# EAGLE design 8-Bit Selector (2-to-1) (EAGLE 7.5.0)
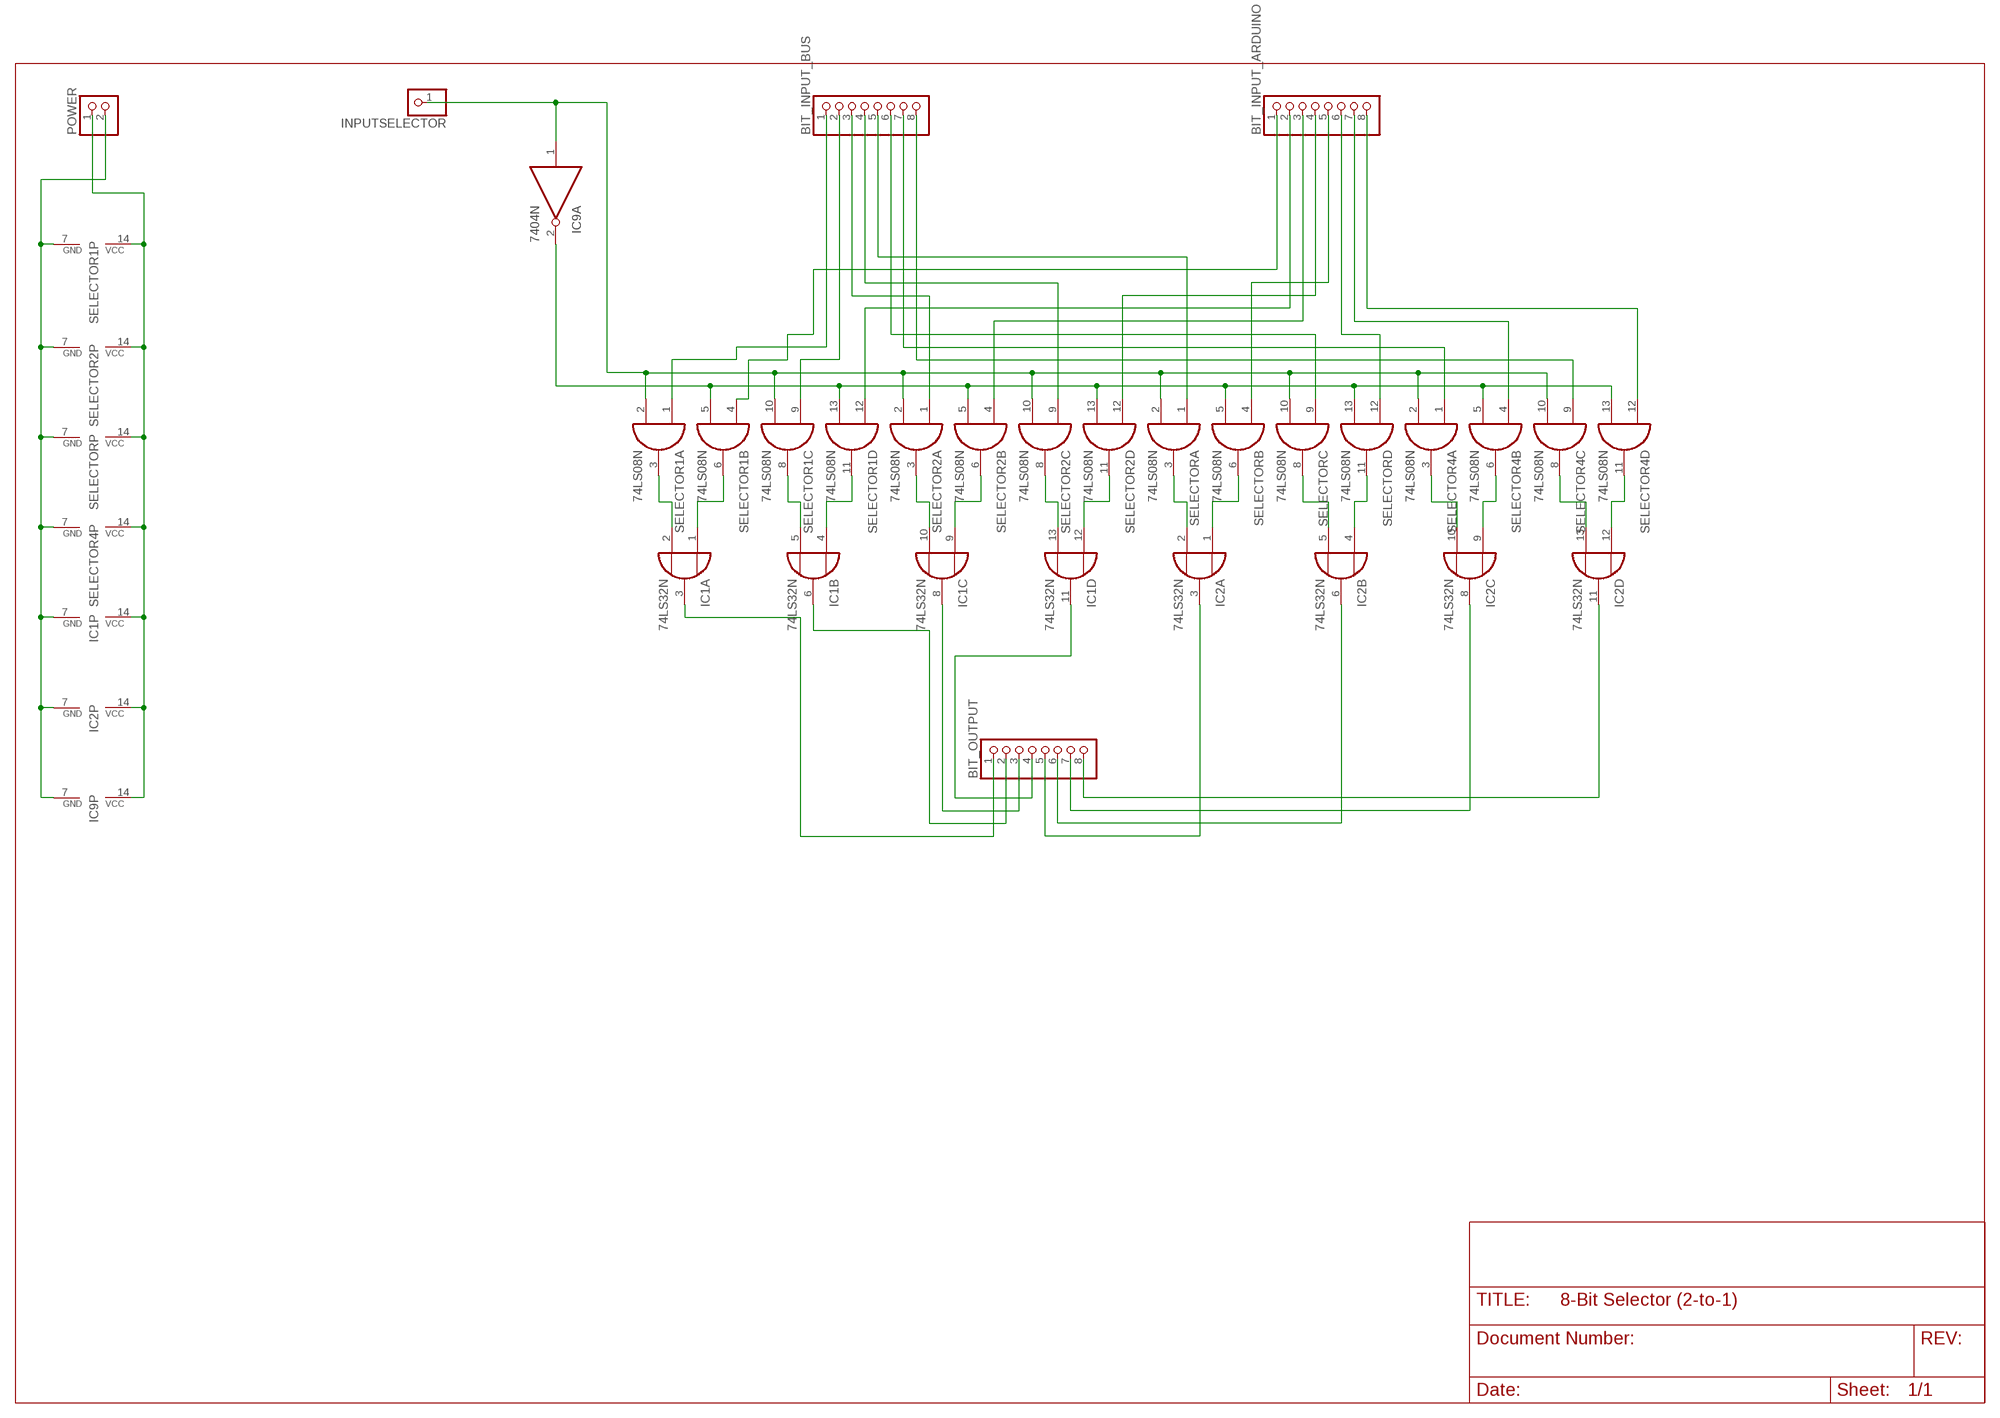
[diagram p0: schematic, sheet 1]

## Parts
BIT_INPUT_ARDUINO  PINHD-1X8  [1X08]
BIT_INPUT_BUS  PINHD-1X8  [1X08]
BIT_OUTPUT  PINHD-1X8  [1X08]
IC1  74LS32N  [DIL14]
IC2  74LS32N  [DIL14]
IC9  7404N  [DIL14]
INPUTSELECTOR  PINHD-1X1  [1X01]
POWER  PINHD-1X2  [1X02]
SELECTOR  74LS08N  [DIL14]
SELECTOR1  74LS08N  [DIL14]
SELECTOR2  74LS08N  [DIL14]
SELECTOR4  74LS08N  [DIL14]

## Nets
GND: IC1.7(P:GND) IC2.7(P:GND) IC9.7(P:GND) POWER.2 SELECTOR1.7(P:GND) SELECTOR2.7(P:GND) SELECTOR4.7(P:GND) SELECTOR.7(P:GND)
N$3: IC9.1(A:I) INPUTSELECTOR.1 SELECTOR1.2(A:I1) SELECTOR1.10(C:I1) SELECTOR2.2(A:I1) SELECTOR2.10(C:I1) SELECTOR4.2(A:I1) SELECTOR4.10(C:I1) SELECTOR.2(A:I1) SELECTOR.10(C:I1)
N$5: IC9.2(A:O) SELECTOR1.5(B:I1) SELECTOR1.13(D:I1) SELECTOR2.5(B:I1) SELECTOR2.13(D:I1) SELECTOR4.5(B:I1) SELECTOR4.13(D:I1) SELECTOR.5(B:I1) SELECTOR.13(D:I1)
N$6: BIT_INPUT_BUS.1 SELECTOR1.1(A:I0)
N$7: BIT_INPUT_ARDUINO.1 SELECTOR1.4(B:I0)
N$8: BIT_INPUT_BUS.2 SELECTOR1.9(C:I0)
N$9: BIT_INPUT_ARDUINO.2 SELECTOR1.12(D:I0)
N$10: BIT_INPUT_BUS.3 SELECTOR2.1(A:I0)
N$11: BIT_INPUT_ARDUINO.3 SELECTOR2.4(B:I0)
N$12: BIT_INPUT_BUS.4 SELECTOR2.9(C:I0)
N$13: BIT_INPUT_ARDUINO.4 SELECTOR2.12(D:I0)
N$14: BIT_INPUT_BUS.5 SELECTOR.1(A:I0)
N$15: BIT_INPUT_ARDUINO.5 SELECTOR.4(B:I0)
N$16: BIT_INPUT_BUS.6 SELECTOR.9(C:I0)
N$17: BIT_INPUT_ARDUINO.6 SELECTOR.12(D:I0)
N$18: BIT_INPUT_BUS.7 SELECTOR4.1(A:I0)
N$19: BIT_INPUT_ARDUINO.7 SELECTOR4.4(B:I0)
N$20: BIT_INPUT_BUS.8 SELECTOR4.9(C:I0)
N$21: BIT_INPUT_ARDUINO.8 SELECTOR4.12(D:I0)
N$30: BIT_OUTPUT.6 IC2.6(B:O)
N$39: IC1.2(A:I1) SELECTOR1.3(A:O)
N$40: IC1.1(A:I0) SELECTOR1.6(B:O)
N$41: IC1.5(B:I1) SELECTOR1.8(C:O)
N$42: IC1.4(B:I0) SELECTOR1.11(D:O)
N$43: IC1.10(C:I1) SELECTOR2.3(A:O)
N$44: IC1.9(C:I0) SELECTOR2.6(B:O)
N$45: IC1.13(D:I1) SELECTOR2.8(C:O)
N$46: IC1.12(D:I0) SELECTOR2.11(D:O)
N$47: IC2.2(A:I1) SELECTOR.3(A:O)
N$48: IC2.1(A:I0) SELECTOR.6(B:O)
N$49: IC2.5(B:I1) SELECTOR.8(C:O)
N$50: IC2.4(B:I0) SELECTOR.11(D:O)
N$51: IC2.10(C:I1) SELECTOR4.3(A:O)
N$52: IC2.9(C:I0) SELECTOR4.6(B:O)
N$53: IC2.13(D:I1) SELECTOR4.8(C:O)
N$54: IC2.12(D:I0) SELECTOR4.11(D:O)
N$55: BIT_OUTPUT.1 IC1.3(A:O)
N$72: BIT_OUTPUT.2 IC1.6(B:O)
N$73: BIT_OUTPUT.3 IC1.8(C:O)
N$74: BIT_OUTPUT.4 IC1.11(D:O)
N$75: BIT_OUTPUT.5 IC2.3(A:O)
N$76: BIT_OUTPUT.7 IC2.8(C:O)
N$77: BIT_OUTPUT.8 IC2.11(D:O)
VCC: IC1.14(P:VCC) IC2.14(P:VCC) IC9.14(P:VCC) POWER.1 SELECTOR1.14(P:VCC) SELECTOR2.14(P:VCC) SELECTOR4.14(P:VCC) SELECTOR.14(P:VCC)
Unconnected: IC9.3(B:I) IC9.4(B:O) IC9.5(C:I) IC9.6(C:O) IC9.8(D:O) IC9.9(D:I) IC9.10(E:O) IC9.11(E:I) IC9.12(F:O) IC9.13(F:I)

## Library data of the parts
BIT_INPUT_ARDUINO BIT_INPUT_BUS BIT_OUTPUT = pinhead:PINHD-1X8: PIN HEADER
IC1 IC2 = 74xx-eu:74*32: Quad 2-input OR gate
IC9 = 74xx-eu:74*04: Hex INVERTER
INPUTSELECTOR = pinhead:PINHD-1X1: PIN HEADER
POWER = pinhead:PINHD-1X2: PIN HEADER
SELECTOR SELECTOR1 SELECTOR2 SELECTOR4 = 74xx-eu:74*08: Quad 2-input AND gate

## Board
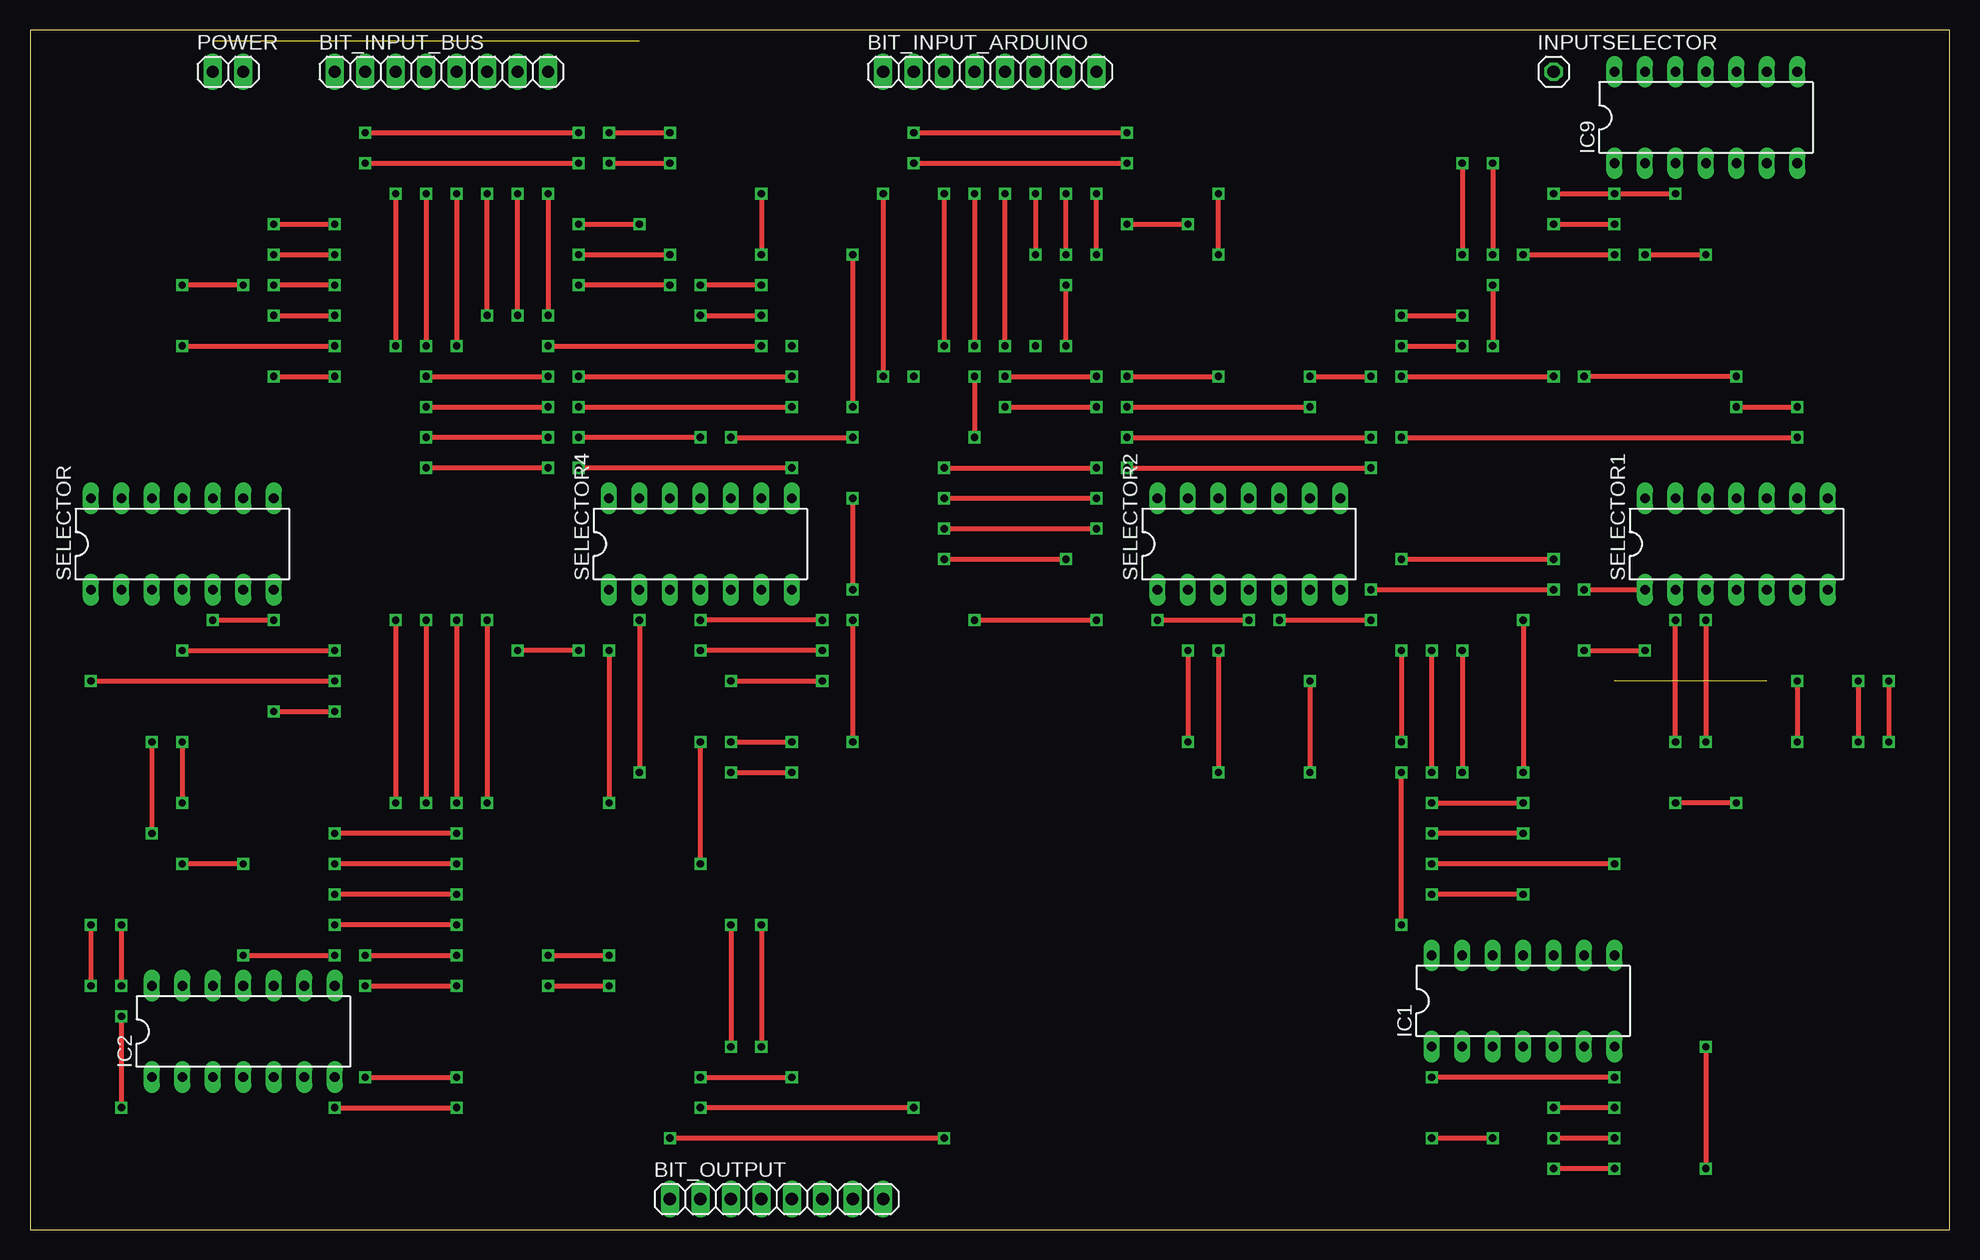
[diagram p1: board, top side]
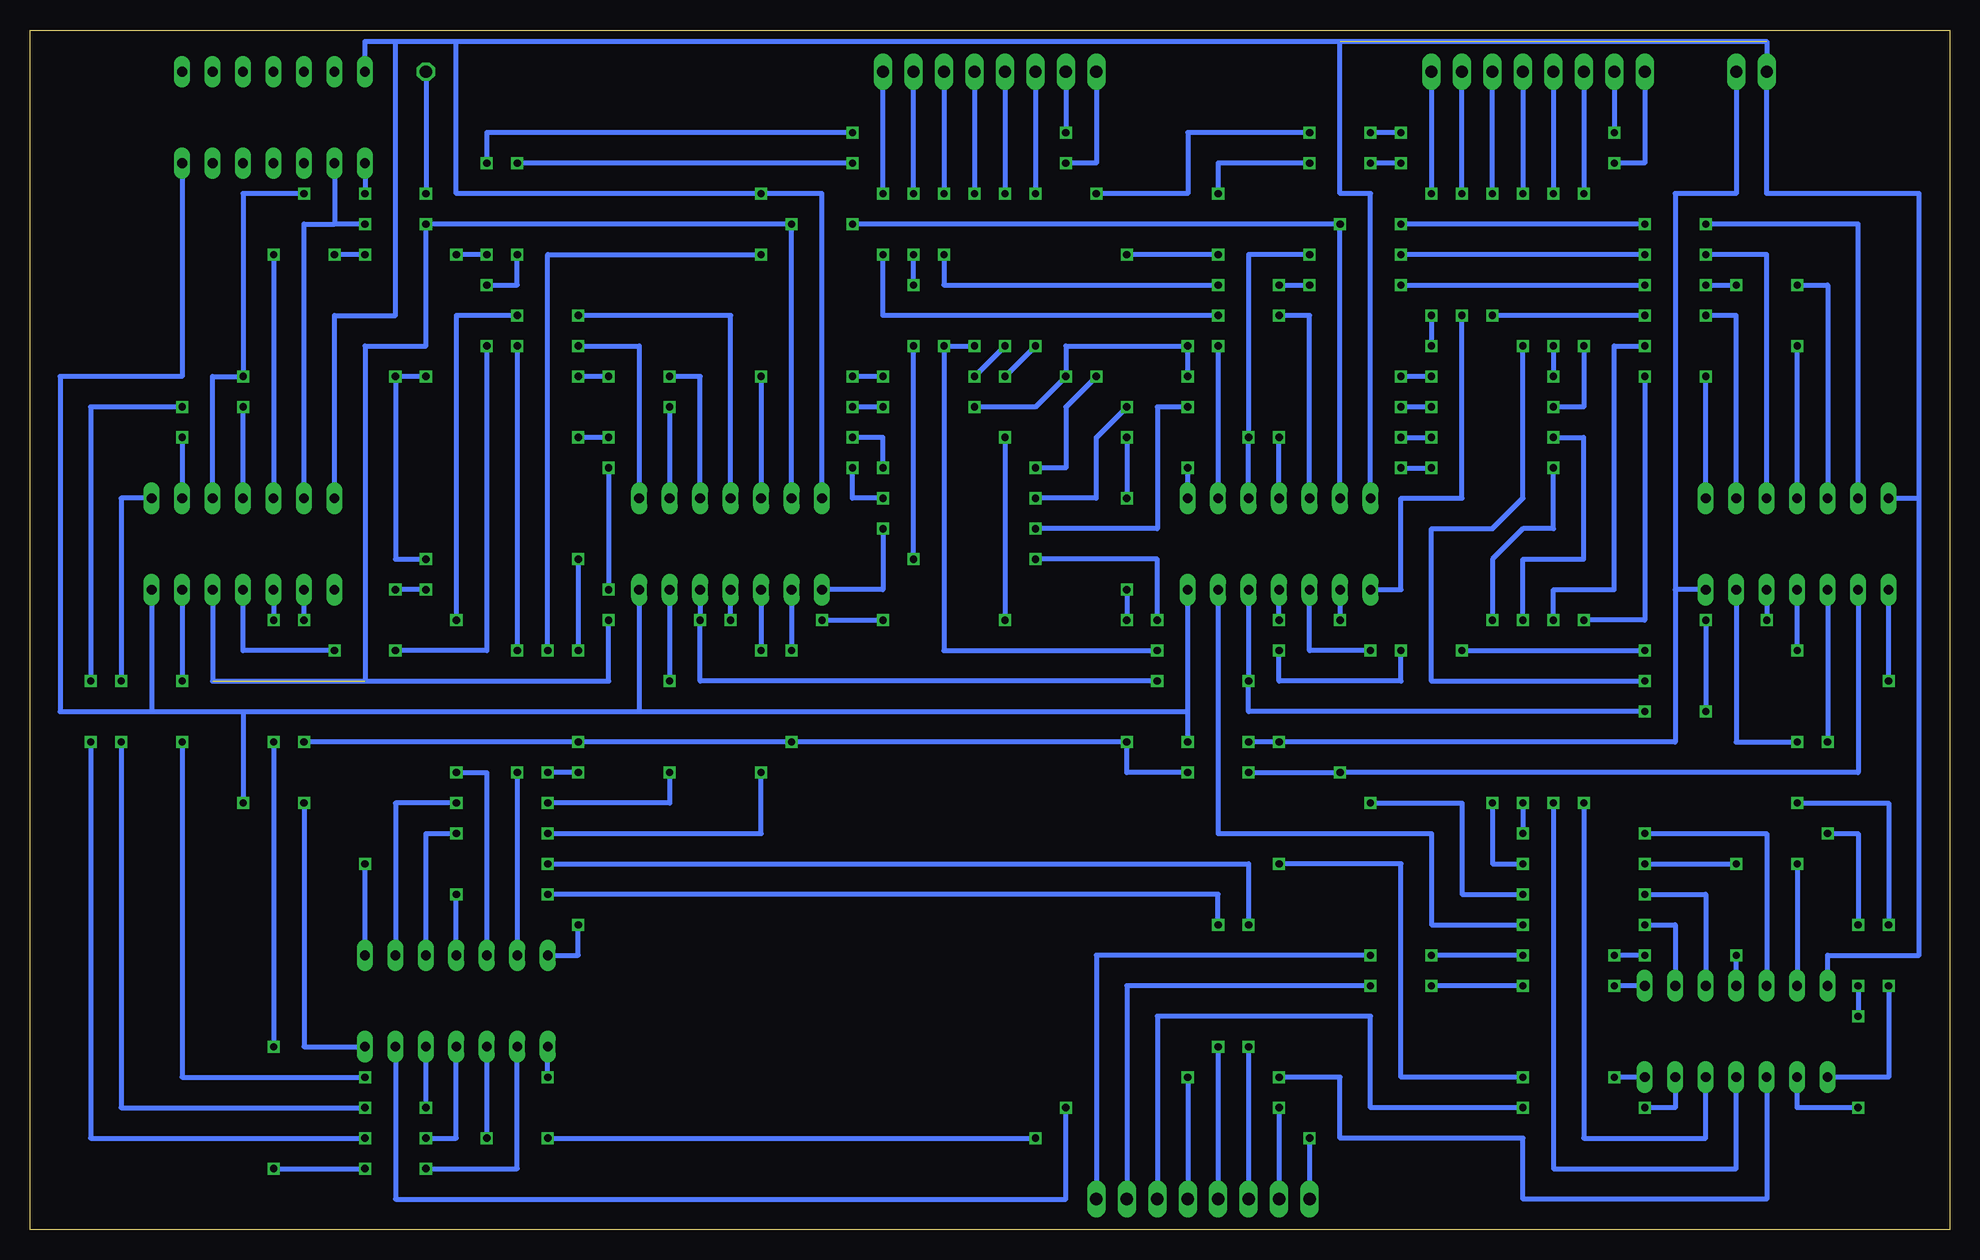
[diagram p2: board, bottom side, seen from below]

Size 160 x 100 mm. Coordinates in mm from the lower left corner, seen from the top.
Outline: 0,0 160,0 160,100 0,100 0,0
Copper layers (1*16): Top 0.035mm / dielectric 1.5mm / Bottom 0.035mm
Design rules "default": minimum track width 10mil, minimum drill 24mil, track to track 8mil, track to pad 8mil, pad to pad 8mil, via to via 8mil, smd to smd 8mil, copper to edge 40mil, drill to drill 8mil, minimum pad ring 10mil, minimum via ring 8mil, stop-mask expansion 4mil, vias tented up to drill 0mil, thermal gap 10mil

### Footprints (pad centres in the part's own frame; a part is rotated, then mirrored left to right if it is on the bottom)
1X08 = drill 1.016 long: 1 -8.89,0; 2 -6.35,0; 3 -3.81,0; 4 -1.27,0; 5 1.27,0; 6 3.81,0; 7 6.35,0; 8 8.89,0
DIL14 = drill 0.813 long: 1 -7.62,-3.81; 2 -5.08,-3.81; 3 -2.54,-3.81; 4 0,-3.81; 5 2.54,-3.81; 6 5.08,-3.81; 7 7.62,-3.81; 8 7.62,3.81; 9 5.08,3.81; 10 2.54,3.81; 11 0,3.81; 12 -2.54,3.81; 13 -5.08,3.81; 14 -7.62,3.81
1X01 = drill 1.016 octagon: 1 0,0
1X02 = drill 1.016 long: 1 -1.27,0; 2 1.27,0

### Placement (x,y rotation side)
BIT_INPUT_ARDUINO  80.01,96.52 0 top
BIT_INPUT_BUS  34.29,96.52 0 top
BIT_OUTPUT  62.23,2.54 0 top
IC1  124.46,19.05 0 top
IC2  17.78,16.51 0 top
IC9  139.7,92.71 0 top
INPUTSELECTOR  127,96.52 0 top
POWER  16.51,96.52 0 top
SELECTOR  12.7,57.15 0 top
SELECTOR1  142.24,57.15 0 top
SELECTOR2  101.6,57.15 0 top
SELECTOR4  55.88,57.15 0 top

### Tracks (layer width: path | path; a pad name or v marks a point on that pad's centre or on a via)
GND  (via drill 0.6)
  Top 0.406: v142.24,35.56 v137.16,35.56 | v55.88,30.48 v55.88,40.64 | v58.42,40.64 v63.5,40.64 | v27.94,12.7 v35.56,12.7
  Bottom 0.406: IC9.7 147.32,71.12 157.48,71.12 157.48,43.18 149.86,43.18 | 149.86,43.18 142.24,43.18 | 142.24,43.18 v142.24,35.56 | v137.16,35.56 137.16,15.24 IC1.7 | SELECTOR1.7 149.86,43.18 | 142.24,43.18 109.22,43.18 | POWER.2 17.78,86.36 22.86,86.36 22.86,53.34 | 22.86,53.34 22.86,40.64 v55.88,40.64 v58.42,40.64 | v63.5,40.64 63.5,43.18 | 63.5,43.18 SELECTOR4.7 | SELECTOR.7 22.86,53.34 | v55.88,30.48 45.72,30.48 45.72,12.7 v35.56,12.7 | SELECTOR2.7 109.22,43.18 | IC2.7 v27.94,12.7 | 109.22,43.18 63.5,43.18
N$3  (via drill 0.6)
  Top 0.406: v58.42,38.1 v63.5,38.1 | v137.16,40.64 v137.16,50.8 | v96.52,48.26 v96.52,40.64 | v50.8,50.8 v50.8,38.1 | v114.3,48.26 v114.3,40.64 | v127,86.36 v132.08,86.36 v137.16,86.36 | v106.68,71.12 v111.76,71.12 | v114.3,71.12 v127,71.12 | v114.3,55.88 v127,55.88 | v142.24,71.12 v129.54,71.12 | v58.42,66.04 v68.58,66.04 | v68.58,60.96 v68.58,53.34 | v68.58,50.8 v68.58,40.64 | v20.32,81.28 v25.4,81.28 | v45.72,81.28 v53.34,81.28
  Bottom 0.406: SELECTOR.2 7.62,38.1 v50.8,38.1 v58.42,38.1 | v137.16,40.64 v114.3,40.64 v96.52,40.64 v68.58,40.64 68.58,38.1 v63.5,38.1 | v137.16,50.8 SELECTOR1.2 | SELECTOR2.2 v96.52,48.26 | SELECTOR4.2 v50.8,50.8 | v114.3,55.88 v114.3,48.26 | INPUTSELECTOR.1 v127,86.36 | IC9.1 v132.08,86.36 | SELECTOR2.10 104.14,71.12 v106.68,71.12 | v111.76,71.12 v114.3,71.12 | v127,71.12 v129.54,71.12 129.54,55.88 v127,55.88 | SELECTOR1.10 144.78,71.12 v142.24,71.12 142.24,86.36 v137.16,86.36 | SELECTOR4.10 v58.42,66.04 58.42,81.28 v53.34,81.28 | v68.58,66.04 v68.58,60.96 | v68.58,53.34 v68.58,50.8 | SELECTOR.10 15.24,81.28 v20.32,81.28 | v25.4,81.28 v45.72,81.28
N$5  (via drill 0.6)  (1 unrouted)
  Top 0.406: v127,83.82 v132.08,83.82 | v104.14,50.8 v111.76,50.8 | v58.42,45.72 v66.04,45.72 | v91.44,83.82 v96.52,83.82 | v20.32,83.82 v25.4,83.82 | v45.72,83.82 v50.8,83.82 | v15.24,50.8 v20.32,50.8 | v20.32,43.18 v25.4,43.18
  Bottom 0.406: IC9.2 134.62,83.82 | SELECTOR2.13 v96.52,83.82 v127,83.82 127,73.66 132.08,73.66 132.08,45.72 | v132.08,83.82 134.62,83.82 | SELECTOR2.5 v104.14,50.8 104.14,45.72 v66.04,45.72 | SELECTOR4.5 v58.42,45.72 58.42,43.18 v25.4,43.18 | SELECTOR1.5 144.78,45.72 132.08,45.72 | SELECTOR4.13 v50.8,83.82 v91.44,83.82 | SELECTOR.13 7.62,83.82 v20.32,83.82 | v25.4,83.82 v45.72,83.82 | SELECTOR.5 v15.24,50.8 | v20.32,50.8 v20.32,43.18 | 132.08,45.72 111.76,45.72 v111.76,50.8 | SELECTOR1.13 137.16,83.82 134.62,83.82
N$6  (via drill 0.6)
  Top 0.406: v27.94,88.9 v45.72,88.9 | v48.26,88.9 v53.34,88.9 | v60.96,86.36 v60.96,81.28 | v68.58,81.28 v68.58,68.58 | v76.2,60.96 v88.9,60.96 | v91.44,63.5 v111.76,63.5 | v111.76,53.34 v127,53.34 | v129.54,53.34 SELECTOR1.1
  Bottom 0.406: BIT_INPUT_BUS.1 25.4,88.9 v27.94,88.9 | v45.72,88.9 v48.26,88.9 | v53.34,88.9 60.96,88.9 v60.96,86.36 | v60.96,81.28 v68.58,81.28 | v76.2,60.96 71.12,60.96 71.12,66.04 v68.58,68.58 | v88.9,60.96 91.44,60.96 v91.44,63.5 | v111.76,63.5 v111.76,53.34 | v127,53.34 v129.54,53.34
  other vias: 134.62,53.34
N$7  (via drill 0.6)
  Top 0.406: v73.66,88.9 v91.44,88.9 | v119.38,88.9 v119.38,81.28 | v121.92,78.74 v121.92,73.66 | v129.54,48.26 v134.62,48.26
  Bottom 0.406: BIT_INPUT_ARDUINO.1 71.12,88.9 v73.66,88.9 | v91.44,88.9 v119.38,88.9 | v121.92,73.66 121.92,48.26 v129.54,48.26 | v134.62,48.26 142.24,48.26 SELECTOR1.4 | v121.92,78.74 119.38,78.74 v119.38,81.28
N$8  (via drill 0.6)
  Top 0.406: v27.94,91.44 v45.72,91.44 | v48.26,91.44 v53.34,91.44 | v71.12,86.36 v71.12,71.12 | v76.2,63.5 v88.9,63.5 | v91.44,66.04 v111.76,66.04 | v114.3,66.04 v147.32,66.04
  Bottom 0.406: BIT_INPUT_BUS.2 v27.94,91.44 | v45.72,91.44 v48.26,91.44 | v53.34,91.44 63.5,91.44 63.5,86.36 v71.12,86.36 | v71.12,71.12 73.66,68.58 73.66,63.5 v76.2,63.5 | v88.9,63.5 88.9,66.04 v91.44,66.04 | v111.76,66.04 v114.3,66.04 | v147.32,66.04 SELECTOR1.9
N$9  (via drill 0.6)
  Top 0.406: v73.66,91.44 v91.44,91.44 | v121.92,88.9 v121.92,81.28 | v124.46,81.28 v132.08,81.28 | v134.62,81.28 v139.7,81.28
  Bottom 0.406: BIT_INPUT_ARDUINO.2 v73.66,91.44 | v121.92,81.28 v124.46,81.28 | v139.7,81.28 SELECTOR1.12 | v132.08,81.28 v134.62,81.28 | v91.44,91.44 121.92,91.44 v121.92,88.9
N$10  (via drill 0.6)
  Top 0.406: v30.48,86.36 v30.48,73.66 | v33.02,68.58 v43.18,68.58 | v45.72,68.58 v63.5,68.58 | v76.2,58.42 v88.9,58.42
  Bottom 0.406: BIT_INPUT_BUS.3 v30.48,86.36 | v30.48,73.66 30.48,68.58 v33.02,68.58 | v43.18,68.58 v45.72,68.58 | v63.5,68.58 66.04,68.58 66.04,58.42 v76.2,58.42 | v88.9,58.42 88.9,53.34 SELECTOR2.1
N$11  (via drill 0.6)
  Top 0.406: v76.2,86.36 v76.2,73.66 | v78.74,71.12 v78.74,66.04 | v78.74,50.8 v88.9,50.8 | v93.98,50.8 v101.6,50.8
  Bottom 0.406: BIT_INPUT_ARDUINO.3 v76.2,86.36 | v76.2,73.66 v78.74,71.12 | v78.74,66.04 v78.74,50.8 | v101.6,50.8 SELECTOR2.4 | v93.98,50.8 v88.9,50.8
N$12  (via drill 0.6)
  Top 0.406: v33.02,86.36 v33.02,73.66 | v33.02,71.12 v43.18,71.12 | v91.44,68.58 v106.68,68.58 | v81.28,68.58 v88.9,68.58 | v45.72,71.12 v63.5,71.12
  Bottom 0.406: BIT_INPUT_BUS.4 v33.02,86.36 | v33.02,73.66 v33.02,71.12 | v43.18,71.12 v45.72,71.12 | v88.9,68.58 v91.44,68.58 | v106.68,68.58 SELECTOR2.9 | v63.5,71.12 v63.5,73.66 73.66,73.66 v73.66,71.12 76.2,68.58 v81.28,68.58
N$13  (via drill 0.6)
  Top 0.406: v78.74,86.36 v78.74,73.66 | v81.28,71.12 v88.9,71.12 | v91.44,71.12 v99.06,71.12
  Bottom 0.406: BIT_INPUT_ARDUINO.4 v78.74,86.36 | v78.74,73.66 v81.28,71.12 | v88.9,71.12 v91.44,71.12 | v99.06,71.12 SELECTOR2.12
N$14  (via drill 0.6)
  Top 0.406: v35.56,86.36 v35.56,73.66 | v5.08,45.72 v25.4,45.72
  Bottom 0.406: BIT_INPUT_BUS.5 v35.56,86.36 | v25.4,45.72 43.18,45.72 43.18,58.42 38.1,58.42 35.56,60.96 v35.56,73.66 | v5.08,45.72 SELECTOR.1
N$15  (via drill 0.6)
  Top 0.406: v66.04,48.26 v55.88,48.26 | v45.72,48.26 v40.64,48.26 | v12.7,48.26 v25.4,48.26 | v81.28,73.66 v81.28,86.36
  Bottom 0.406: BIT_INPUT_ARDUINO.5 v81.28,86.36 | v66.04,48.26 83.82,48.26 v83.82,73.66 v81.28,73.66 | v45.72,48.26 45.72,45.72 55.88,45.72 v55.88,48.26 | v40.64,48.26 v25.4,48.26 | v12.7,48.26 SELECTOR.4
N$16  (via drill 0.6)
  Top 0.406: v20.32,76.2 v25.4,76.2 | v38.1,76.2 v38.1,86.36
  Bottom 0.406: SELECTOR.9 17.78,76.2 v20.32,76.2 | v25.4,76.2 v38.1,76.2 | v38.1,86.36 BIT_INPUT_BUS.6
N$17  (via drill 0.6)
  Top 0.406: v83.82,86.36 v83.82,81.28 | v60.96,78.74 v55.88,78.74 | v53.34,78.74 v45.72,78.74 | v25.4,78.74 v20.32,78.74 | v17.78,78.74 v12.7,78.74
  Bottom 0.406: BIT_INPUT_ARDUINO.6 v83.82,86.36 | v83.82,81.28 83.82,78.74 v60.96,78.74 | v55.88,78.74 v53.34,78.74 | v45.72,78.74 v25.4,78.74 | v20.32,78.74 v17.78,78.74 | v12.7,78.74 10.16,78.74 SELECTOR.12
N$18  (via drill 0.6)
  Top 0.406: v40.64,76.2 v40.64,86.36
  Bottom 0.406: v40.64,86.36 BIT_INPUT_BUS.7 | SELECTOR4.1 45.72,53.34 45.72,60.96 40.64,60.96 v40.64,76.2
N$19  (via drill 0.6)
  Top 0.406: v66.04,50.8 v55.88,50.8 | v76.2,55.88 v86.36,55.88 | v86.36,73.66 v86.36,78.74 | v86.36,81.28 v86.36,86.36
  Bottom 0.406: v55.88,50.8 SELECTOR4.4 | v66.04,50.8 66.04,55.88 v76.2,55.88 | v86.36,55.88 v86.36,73.66 | v86.36,78.74 v86.36,81.28 | v86.36,86.36 BIT_INPUT_ARDUINO.7
N$20  (via drill 0.6)
  Top 0.406: v43.18,86.36 v43.18,76.2 | v43.18,73.66 v60.96,73.66
  Bottom 0.406: BIT_INPUT_BUS.8 v43.18,86.36 | v43.18,76.2 v43.18,73.66 | v60.96,73.66 SELECTOR4.9
N$21  (via drill 0.6)
  Top 0.406: v55.88,76.2 v60.96,76.2 | v88.9,81.28 v88.9,86.36
  Bottom 0.406: SELECTOR4.12 53.34,76.2 v55.88,76.2 | v60.96,76.2 88.9,76.2 v88.9,81.28 | v88.9,86.36 BIT_INPUT_ARDUINO.8
N$30  (via drill 0.6)
  Top 0.406: v25.4,10.16 v35.56,10.16
  Bottom 0.406: IC2.6 22.86,10.16 v25.4,10.16 | v35.56,10.16 48.26,10.16 48.26,17.78 66.04,17.78 BIT_OUTPUT.6
N$39  (via drill 0.6)
  Top 0.406: v139.7,50.8 v139.7,40.64 | v139.7,15.24 v139.7,5.08 | v132.08,5.08 v127,5.08
  Bottom 0.406: SELECTOR1.3 v139.7,50.8 | v139.7,40.64 v139.7,15.24 | v139.7,5.08 v132.08,5.08 | v127,5.08 119.38,5.08 IC1.2
N$40  (via drill 0.6)
  Top 0.406: v147.32,45.72 v147.32,40.64 | v132.08,12.7 v116.84,12.7
  Bottom 0.406: SELECTOR1.6 v147.32,45.72 | v147.32,40.64 147.32,12.7 v132.08,12.7 | v116.84,12.7 IC1.1
N$41  (via drill 0.6)
  Top 0.406: v152.4,45.72 v152.4,40.64 | v132.08,10.16 v127,10.16
  Bottom 0.406: SELECTOR1.8 152.4,60.96 v152.4,45.72 | v152.4,40.64 152.4,10.16 v132.08,10.16 | v127,10.16 IC1.5
N$42  (via drill 0.6)
  Top 0.406: v142.24,68.58 v147.32,68.58 | v154.94,45.72 v154.94,40.64 | v132.08,7.62 v127,7.62
  Bottom 0.406: SELECTOR1.11 v142.24,68.58 | v147.32,68.58 154.94,68.58 v154.94,45.72 | v154.94,40.64 154.94,7.62 v132.08,7.62 | v127,7.62 124.46,7.62 IC1.4
N$43  (via drill 0.6)
  Top 0.406: v99.06,48.26 v99.06,38.1 | v124.46,33.02 v116.84,33.02
  Bottom 0.406: SELECTOR2.3 v99.06,48.26 | IC1.10 127,33.02 v124.46,33.02 | v116.84,33.02 99.06,33.02 v99.06,38.1
N$44  (via drill 0.6)
  Top 0.406: v106.68,45.72 v106.68,38.1 | v116.84,35.56 v124.46,35.56
  Bottom 0.406: SELECTOR2.6 v106.68,45.72 | v106.68,38.1 106.68,35.56 v116.84,35.56 | v124.46,35.56 129.54,35.56 IC1.9
N$45  (via drill 0.6)
  Top 0.406: v114.3,73.66 v119.38,73.66 | v119.38,48.26 v119.38,38.1
  Bottom 0.406: v119.38,73.66 v119.38,48.26 | v119.38,38.1 IC1.13 | v114.3,73.66 109.22,73.66 SELECTOR2.8
N$46  (via drill 0.6)
  Top 0.406: v114.3,76.2 v119.38,76.2 | v124.46,50.8 v124.46,38.1
  Bottom 0.406: SELECTOR2.11 101.6,76.2 v114.3,76.2 | v119.38,76.2 124.46,76.2 v124.46,50.8 | v124.46,38.1 121.92,38.1 IC1.12
N$47  (via drill 0.6)
  Top 0.406: v10.16,40.64 v10.16,33.02 | v7.62,25.4 v7.62,20.32 | v7.62,17.78 v7.62,10.16
  Bottom 0.406: SELECTOR.3 v10.16,40.64 | v10.16,33.02 7.62,33.02 v7.62,25.4 | v7.62,20.32 v7.62,17.78 | v7.62,10.16 12.7,10.16 IC2.2
N$48  (via drill 0.6)
  Top 0.406: v12.7,40.64 v12.7,35.56 | v5.08,25.4 v5.08,20.32
  Bottom 0.406: SELECTOR.6 17.78,40.64 v12.7,40.64 | v12.7,35.56 5.08,35.56 v5.08,25.4 | v5.08,20.32 5.08,12.7 IC2.1
N$49  (via drill 0.6)
  Top 0.406: v20.32,71.12 v25.4,71.12 | v30.48,50.8 v30.48,35.56
  Bottom 0.406: SELECTOR.8 v20.32,71.12 | v25.4,71.12 25.4,50.8 v30.48,50.8 | v30.48,35.56 30.48,7.62 20.32,7.62 IC2.5
N$50  (via drill 0.6)
  Top 0.406: v12.7,73.66 v25.4,73.66 | v33.02,50.8 v33.02,35.56
  Bottom 0.406: SELECTOR.11 v12.7,73.66 | v25.4,73.66 27.94,73.66 27.94,53.34 33.02,53.34 v33.02,50.8 | IC2.4 17.78,5.08 33.02,5.08 v33.02,35.56
N$51  (via drill 0.6)
  Top 0.406: v48.26,48.26 v48.26,35.56 | v35.56,27.94 v25.4,27.94
  Bottom 0.406: v48.26,35.56 40.64,35.56 40.64,27.94 v35.56,27.94 | v25.4,27.94 20.32,27.94 IC2.10 | v48.26,48.26 53.34,48.26 SELECTOR4.3
N$52  (via drill 0.6)
  Top 0.406: v35.56,25.4 v25.4,25.4
  Bottom 0.406: SELECTOR4.6 60.96,33.02 43.18,33.02 43.18,25.4 v35.56,25.4 | v25.4,25.4 22.86,25.4 IC2.9
N$53  (via drill 0.6)
  Top 0.406: v63.5,63.5 v45.72,63.5 | v43.18,63.5 v33.02,63.5 | v38.1,50.8 v38.1,35.56 | v35.56,30.48 v25.4,30.48 | v17.78,30.48 v12.7,30.48
  Bottom 0.406: SELECTOR4.8 v63.5,63.5 | v45.72,63.5 v43.18,63.5 | v38.1,35.56 38.1,30.48 v35.56,30.48 | v25.4,30.48 v17.78,30.48 | v12.7,30.48 IC2.13 | v33.02,63.5 33.02,58.42 35.56,58.42 38.1,55.88 v38.1,50.8
N$54  (via drill 0.6)
  Top 0.406: v55.88,66.04 v45.72,66.04 | v43.18,66.04 v33.02,66.04 | v35.56,50.8 v35.56,35.56 | v35.56,33.02 v25.4,33.02
  Bottom 0.406: SELECTOR4.11 v55.88,66.04 | v45.72,66.04 v43.18,66.04 | v33.02,66.04 30.48,66.04 30.48,55.88 35.56,55.88 v35.56,50.8 | v35.56,35.56 v35.56,33.02 | v25.4,33.02 15.24,33.02 IC2.12
N$55  (via drill 0.6)
  Top 0.406: v121.92,7.62 v116.84,7.62 | v76.2,7.62 v53.34,7.62
  Bottom 0.406: IC1.3 v121.92,7.62 | v116.84,7.62 v76.2,7.62 | v53.34,7.62 BIT_OUTPUT.1
N$72  (via drill 0.6)
  Top 0.406: v73.66,10.16 v55.88,10.16
  Bottom 0.406: IC1.6 129.54,2.54 73.66,2.54 v73.66,10.16 | v55.88,10.16 BIT_OUTPUT.2
N$73  (via drill 0.6)
  Top 0.406: v132.08,30.48 v116.84,30.48 | v58.42,25.4 v58.42,15.24
  Bottom 0.406: IC1.8 v132.08,30.48 | v116.84,30.48 58.42,30.48 v58.42,25.4 | v58.42,15.24 BIT_OUTPUT.3
N$74  (via drill 0.6)
  Top 0.406: v124.46,27.94 v116.84,27.94 | v60.96,25.4 v60.96,15.24
  Bottom 0.406: IC1.11 v124.46,27.94 | v60.96,15.24 BIT_OUTPUT.4 | v60.96,25.4 60.96,27.94 v116.84,27.94
N$75  (via drill 0.6)
  Top 0.406: v55.88,12.7 v63.5,12.7
  Bottom 0.406: IC2.3 15.24,2.54 35.56,2.54 35.56,7.62 50.8,7.62 50.8,12.7 v55.88,12.7 | v63.5,12.7 BIT_OUTPUT.5
N$76  (via drill 0.6)
  Top 0.406: v27.94,20.32 v35.56,20.32 | v43.18,20.32 v48.26,20.32
  Bottom 0.406: IC2.8 v27.94,20.32 | v35.56,20.32 v43.18,20.32 | v48.26,20.32 68.58,20.32 BIT_OUTPUT.7
N$77  (via drill 0.6)
  Top 0.406: v17.78,22.86 v25.4,22.86 | v27.94,22.86 v35.56,22.86 | v43.18,22.86 v48.26,22.86
  Bottom 0.406: IC2.11 v17.78,22.86 | v25.4,22.86 v27.94,22.86 | v35.56,22.86 v43.18,22.86 | v48.26,22.86 71.12,22.86 BIT_OUTPUT.8
VCC  (via drill 0.6)  (1 unrouted)
  Top 0.406: v114.3,25.4 v114.3,38.1 | v116.84,38.1 v116.84,48.26 | v99.06,81.28 v99.06,86.36
  Bottom 0.406: 129.54,99.06 132.08,99.06 IC9.14 | 129.54,99.06 124.46,99.06 | 124.46,99.06 50.8,99.06 | 50.8,99.06 15.24,99.06 POWER.1 15.24,86.36 2.54,86.36 2.54,60.96 | SELECTOR2.14 93.98,86.36 v99.06,86.36 124.46,86.36 124.46,99.06 | v114.3,38.1 v116.84,38.1 | v116.84,48.26 116.84,81.28 v99.06,81.28 | IC2.14 10.16,22.86 2.54,22.86 2.54,60.96 | SELECTOR.14 2.54,60.96 | SELECTOR1.14 134.62,76.2 129.54,76.2 129.54,99.06 | SELECTOR4.14 48.26,86.36 50.8,86.36 50.8,99.06 | IC1.14 114.3,22.86 v114.3,25.4